# EAGLE design buttons (EAGLE 9.6.2)
CNAME: ZDS Shifter Pro; CREVISION: B; DESIGNER: D. Kadrioski
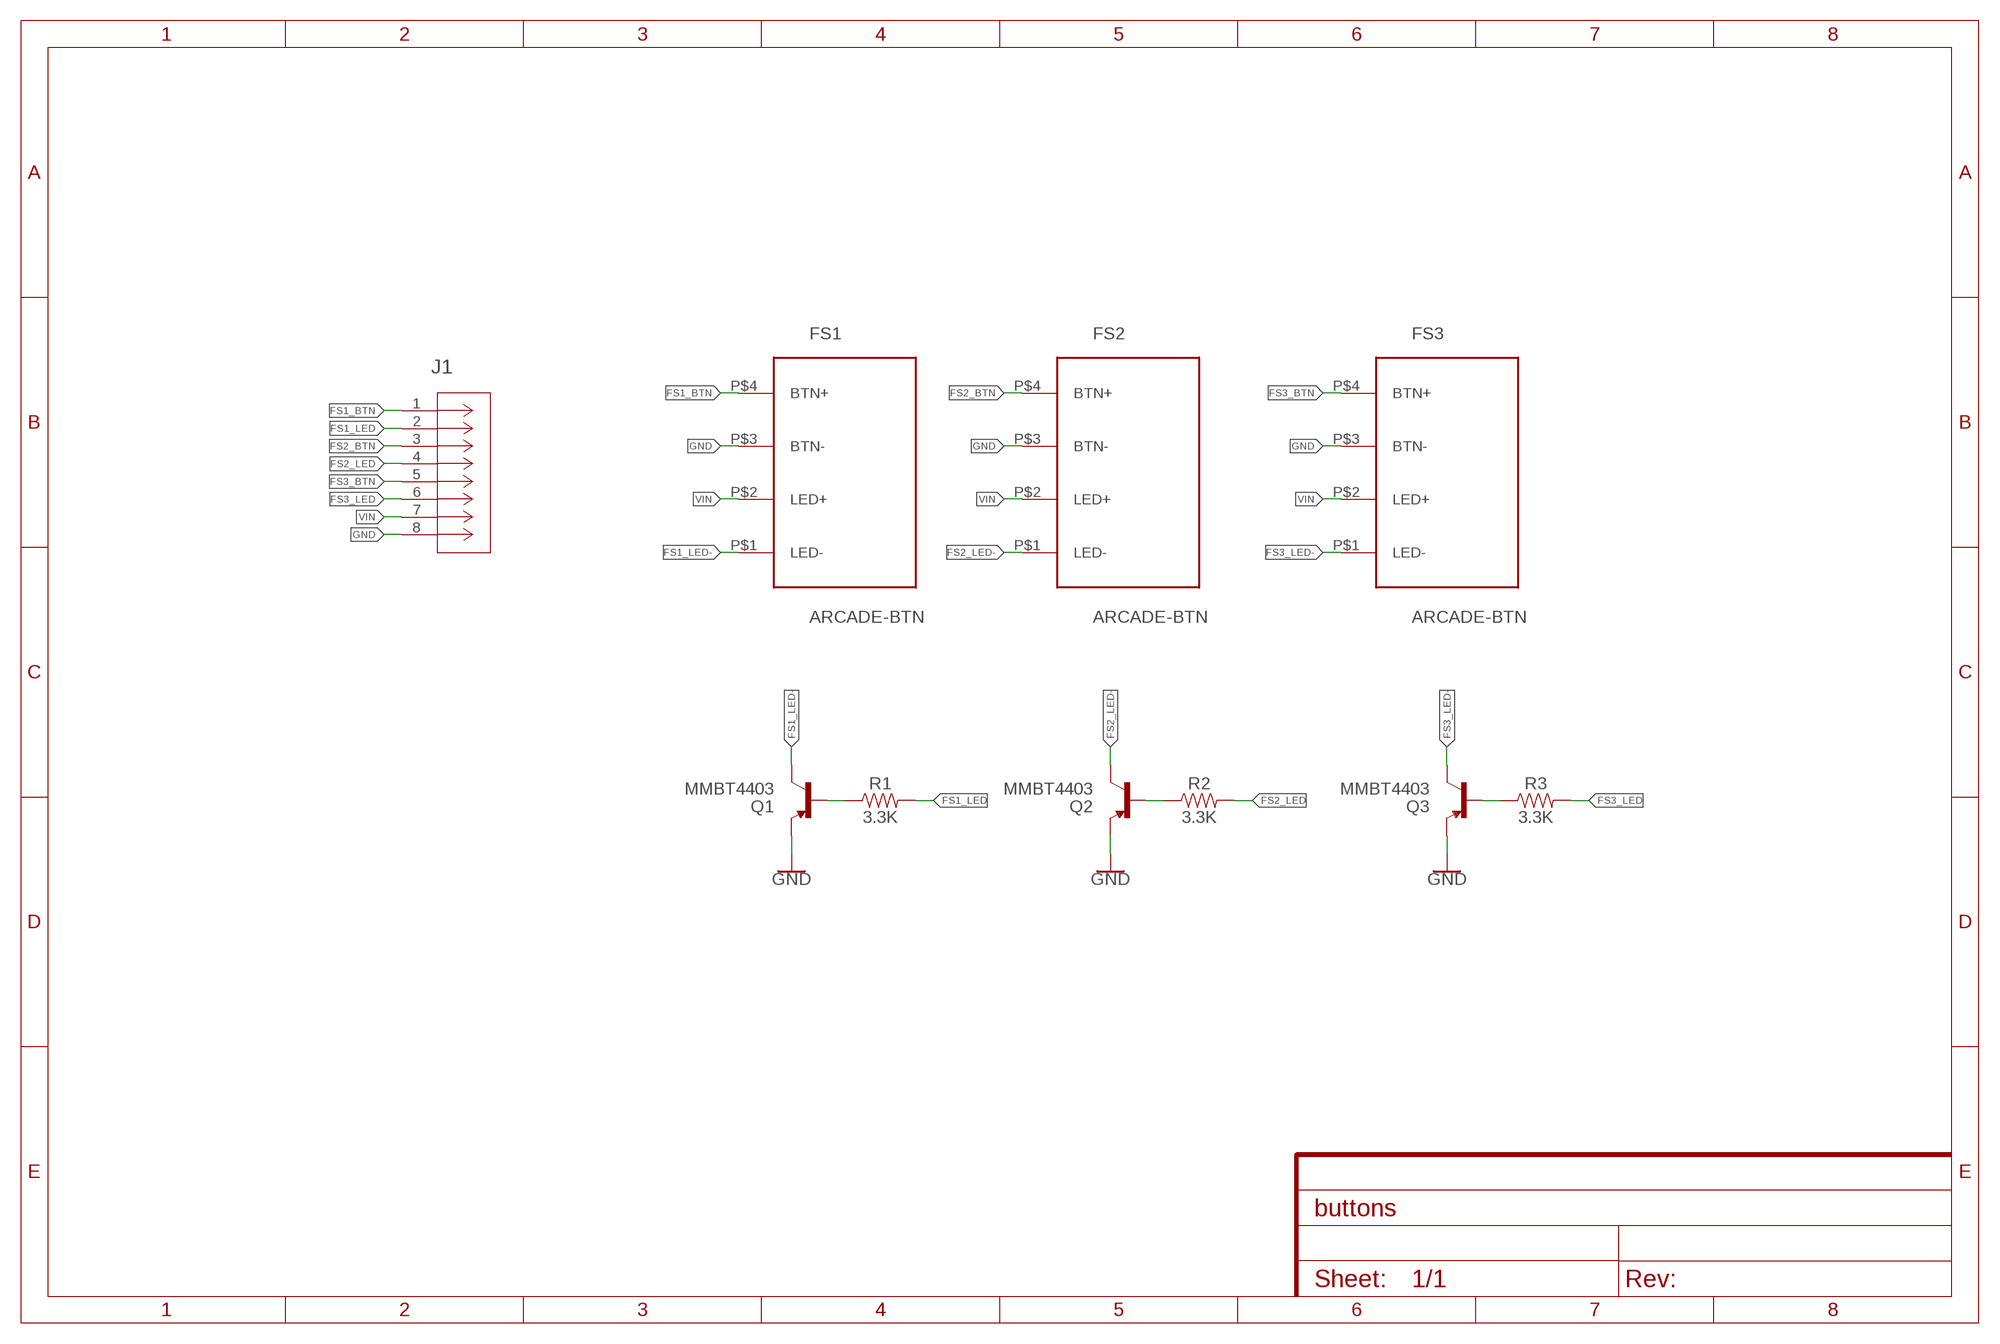
[diagram p0: schematic, sheet 1]

## Parts
FS1  ARCADE-BTN  [ARCADE-BTN]
FS2  ARCADE-BTN  [ARCADE-BTN]
FS3  ARCADE-BTN  [ARCADE-BTN]
J1  188275-8  [CONN_188275-8_TYC]
Q1  MMBT4403  TRANSISTOR_PNPMMBT4403  [SOT23-3]
Q2  MMBT4403  TRANSISTOR_PNPMMBT4403  [SOT23-3]
Q3  MMBT4403  TRANSISTOR_PNPMMBT4403  [SOT23-3]
R1  3.3K  RESISTOR1206  [1206]
R2  3.3K  RESISTOR1206  [1206]
R3  3.3K  RESISTOR1206  [1206]

## Nets
FS1_BTN: FS1.P$4(BTN+) J1.1
FS1_LED: J1.2 R1.2
FS1_LED-: FS1.P$1(LED-) Q1.3(C)
FS2_BTN: FS2.P$4(BTN+) J1.3
FS2_LED: J1.4 R2.2
FS2_LED-: FS2.P$1(LED-) Q2.3(C)
FS3_BTN: FS3.P$4(BTN+) J1.5
FS3_LED: J1.6 R3.2
FS3_LED-: FS3.P$1(LED-) Q3.3(C)
GND [6V]: FS1.P$3(BTN-) FS2.P$3(BTN-) FS3.P$3(BTN-) J1.8 Q1.2(E) Q2.2(E) Q3.2(E)
N$2: Q1.1(B) R1.1
N$10: Q3.1(B) R3.1
N$13: Q2.1(B) R2.1
VIN [6V]: FS1.P$2(LED+) FS2.P$2(LED+) FS3.P$2(LED+) J1.7

## Library data of the parts
FS1-FS3 = arcade-button:ARCADE-BTN
J1 = ul_1882758:188275-8; BUILT_BY: EMA_UL_Team; COPYRIGHT: Copyright (C) 2016 Accelerated Designs. All rights reserved; MANUFACTURER_PART_NUMBER: 188275-8; SOURCELIBRARY: Tyco_2012-06-25; VENDOR: TE Connectivity
Q1-Q3 = User-Submitted:TRANSISTOR_PNP: Generic PNP BJT Double check pinouts against datasheets- not all devices are the same! MMBT3906 - 40V 200mA SOT-23 (TRANS-08052) MMBT4403 - 40V 600mA SOT-23 (TRANS-09245); PROD_ID: TRANS-09245
R1-R3 = SparkFun-Resistors:RESISTOR: Generic Resistor Package

## Net classes
0 default: width 0.25 mm, clearance 0.5 mm
1 6V: width 0.5 mm

## Board
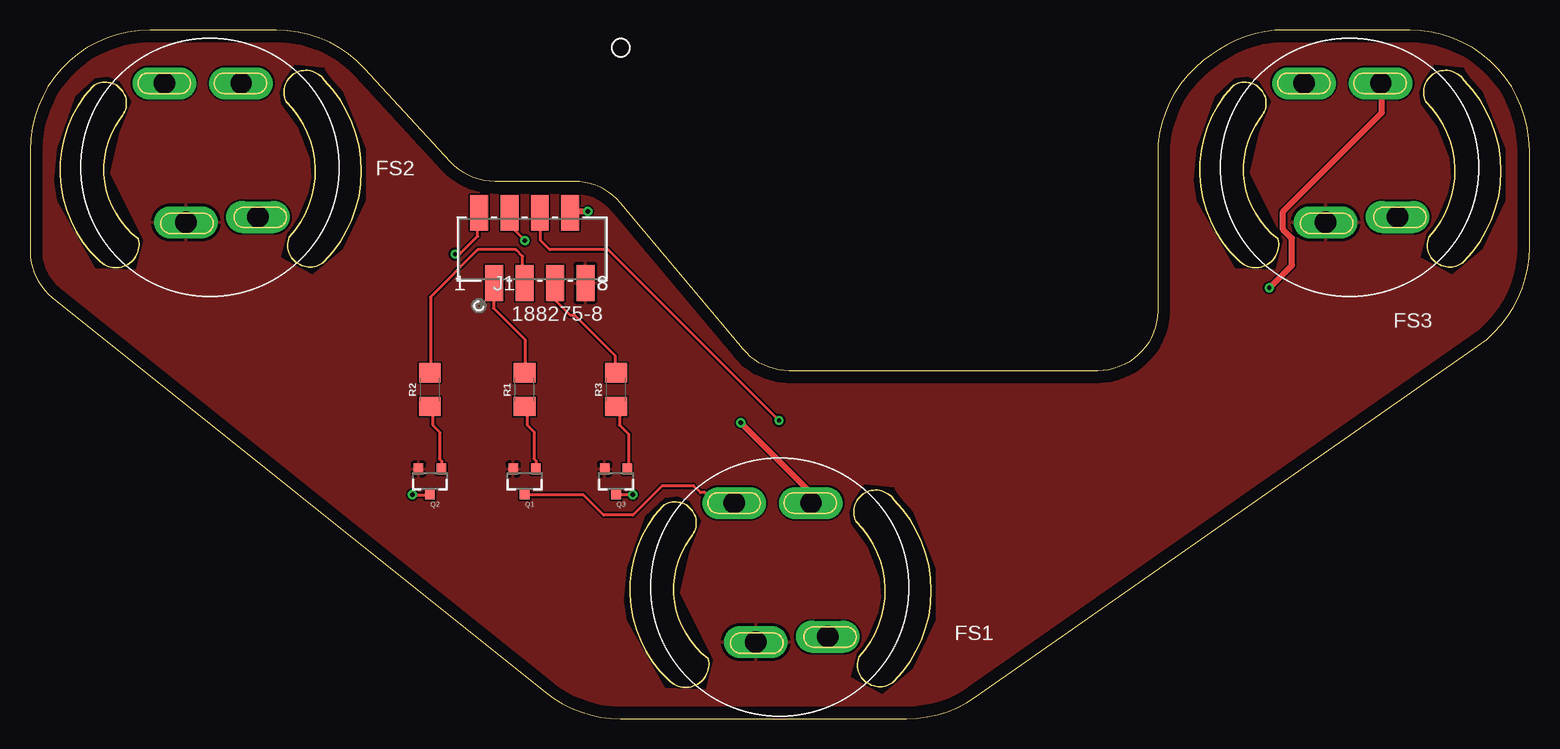
[diagram p1: board, top side]
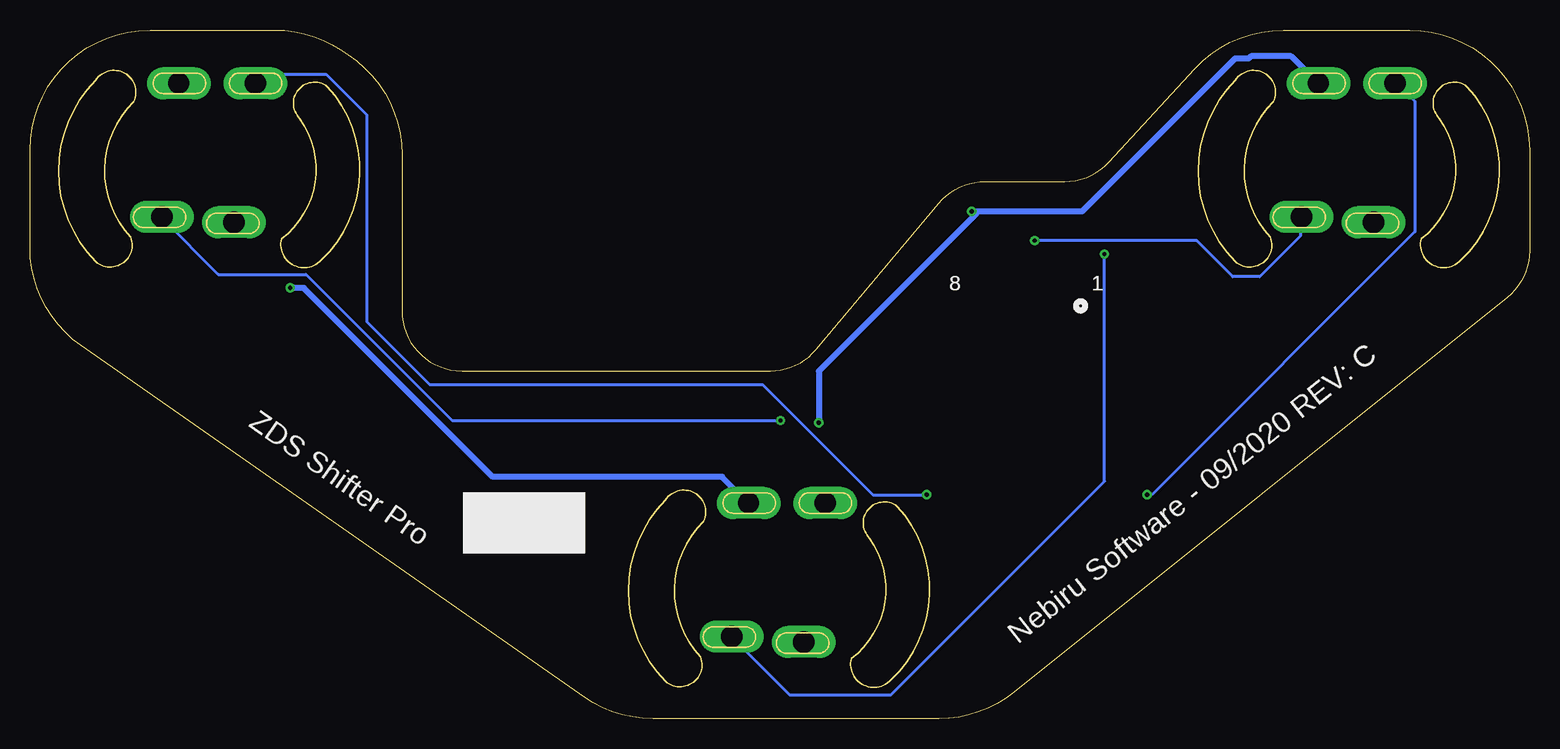
[diagram p2: board, bottom side, seen from below]

Size 125 x 57.44 mm. Coordinates in mm from the lower left corner, seen from the top.
Outline: 35.08,46.41 27.89,54.21 arc47 20.54,57.44 10,57.44 arc90 0,47.44 0,39.04 arc51 1.87,35.14 42.98,2.2 arc39 49.23,0 73.05,0 arc35 78.78,1.8 120.73,31.12 arc55 125,39.31 125,47.44 arc90 115,57.44 104.61,57.44 arc33 99.09,55.78 98.49,55.38 arc57 94,47.04 94,34.02 arc-90 89,29.02 63.29,29.02 arc-50 59.46,30.81 49.22,43.01 arc50 45.39,44.8 38.75,44.8 arc-47 35.08,46.41
Copper layers (1*16): Top 0.035mm / dielectric 1.5mm / Bottom 0.035mm
Design rules "default": minimum track width 6mil, minimum drill 0.35mm, track to track 6mil, track to pad 6mil, pad to pad 6mil, via to via 6mil, smd to smd 6mil, copper to edge 40mil, drill to drill 6mil, minimum pad ring 10mil, minimum via ring 8mil, stop-mask expansion 4mil, vias tented up to drill 0mil, thermal gap 10mil

### Footprints (pad centres in the part's own frame; a part is rotated, then mirrored left to right if it is on the bottom)
ARCADE-BTN = drill 1.778 long: P$1 -3.8,7; P$2 2.6,7; P$3 -2,-4.6; P$4 4,-4.154
CONN_188275-8_TYC = smd 1.499 x 2.997: 1 0,5.85; 2 1.27,0; 3 2.54,5.85; 4 3.81,0; 5 5.08,5.85; 6 6.35,0; 7 7.62,5.85; 8 8.89,0
SOT23-3 = smd 0.8 x 0.9: 1 -0.95,-1; 2 0.95,-1; 3 0,1.1
1206 = smd 1.6 x 1.8: 1 -1.4,0; 2 1.4,0

### Placement (x,y rotation side)
FS1  62.5,11 0 top
FS2  15,46 0 top
FS3  110,46 0 top
J1  37.42,36.34 0 top
Q1  41.23,19.83 180 top
Q2  33.34,19.83 180 top
Q3  48.85,19.83 180 top
R1  41.23,27.45 90 top
R2  33.34,27.45 90 top
R3  48.85,27.45 90 top

### Tracks (layer width: path | path; a pad name or v marks a point on that pad's centre or on a via)
FS1_BTN  (via drill 0.35)
  Top 0.25: v35.44,38.75 35.81,38.75 37.31,40.25 37.31,42.12 J1.1
  Bottom 0.25: v35.44,38.75 35.44,19.81 53.25,2 61.69,2 66.38,6.69 FS1.P$4
FS1_LED
  Top 0.25: R1.2 41.25,29 41.25,31.62 38.62,34.25 38.62,36.31 J1.2
FS1_LED-
  Top 0.25: Q1.3 41.25,18.69 46.12,18.69 47.81,17 50.25,17 52.69,19.44 55.31,19.44 55.88,18.88 56.25,18.88 57,18.12 58.69,18.12 FS1.P$1
FS2_BTN  (via drill 0.35)
  Top 0.25: v41.25,39.88 40.12,41 40.12,42.12 J1.3
  Bottom 0.25: v41.25,39.88 27.75,39.88 24.75,36.88 22.5,36.88 19.12,40.25 19.12,41.75 FS2.P$4
FS2_LED
  Top 0.25: R2.2 33.38,29 33.38,35.19 37.31,39.12 40.5,39.12 41.06,38.56 41.06,36.5 J1.4
FS2_LED-  (via drill 0.35)
  Top 0.25: v31.88,18.69 33.19,18.69 Q2.3
  Bottom 0.25: v31.88,18.69 31.5,18.69 9.56,40.62 9.56,51.5 11.06,53 FS2.P$1
FS3_BTN  (via drill 0.35)
  Top 0.25: v62.44,24.88 48.19,39.12 43.31,39.12 42.56,39.88 42.56,42.12 J1.5
  Bottom 0.25: v62.44,24.88 89.81,24.88 102,37.06 109.31,37.06 114,41.75 FS3.P$4
FS3_LED
  Top 0.25: R3.2 48.75,29 48.75,30.31 45.38,33.69 45,33.69 43.88,34.81 43.88,36.31 J1.6
FS3_LED-  (via drill 0.35)
  Top 0.25: v50.25,18.69 48.94,18.69 Q3.3
  Bottom 0.25: v50.25,18.69 54.75,18.69 63.94,27.88 91.69,27.88 96.94,33.12 96.94,50.38 100.31,53.75 105.38,53.75 106.12,53 FS3.P$1
GND
  pour Top: -5.08,64.58 121.92,64.58 129.54,56.96 129.54,36.64 83.82,-9.08 38.1,-9.08 -5.08,34.1
N$2
  Top 0.25: Q1.1 42.19,20.94 42.19,21.5 42,21.69 42,23.94 41.44,24.5 41.44,25.81 41.25,26 R1.1
N$10
  Top 0.25: Q3.1 49.88,20.94 49.88,23.75 49.12,24.5 49.12,25.81 48.94,26 R3.1
N$13
  Top 0.25: Q2.1 34.31,20.94 34.31,21.5 34.12,21.69 34.12,23.94 33.56,24.5 33.56,25.81 33.38,26 R2.1
VIN  (via drill 0.35)
  Top 0.5: v46.5,42.31 45.19,42.31 J1.7 | v59.25,24.69 65.06,18.88 65.06,18.12 FS1.P$2 | v103.31,35.94 105.19,37.81 105.19,40.06 104.44,40.81 104.44,42.31 112.69,50.56 112.69,53 FS3.P$2
  Bottom 0.5: 46.12,42.31 37.31,42.31 24.56,55.06 23.44,55.06 23.25,55.25 19.88,55.25 17.62,53 FS2.P$2 | 46.12,42.31 v46.5,42.31 | v59.25,24.69 59.25,29 46.12,42.12 46.12,42.31 | v103.31,35.94 102.19,35.94 86.44,20.19 67.31,20.19 65.25,18.12 FS1.P$2

### Text on the board
bPlace: ZDS Shifter Pro | Nebiru Software - 09/2020 REV: C